# EAGLE design batteryholder2S6P_vertical_bottom (EAGLE 9.5.0)
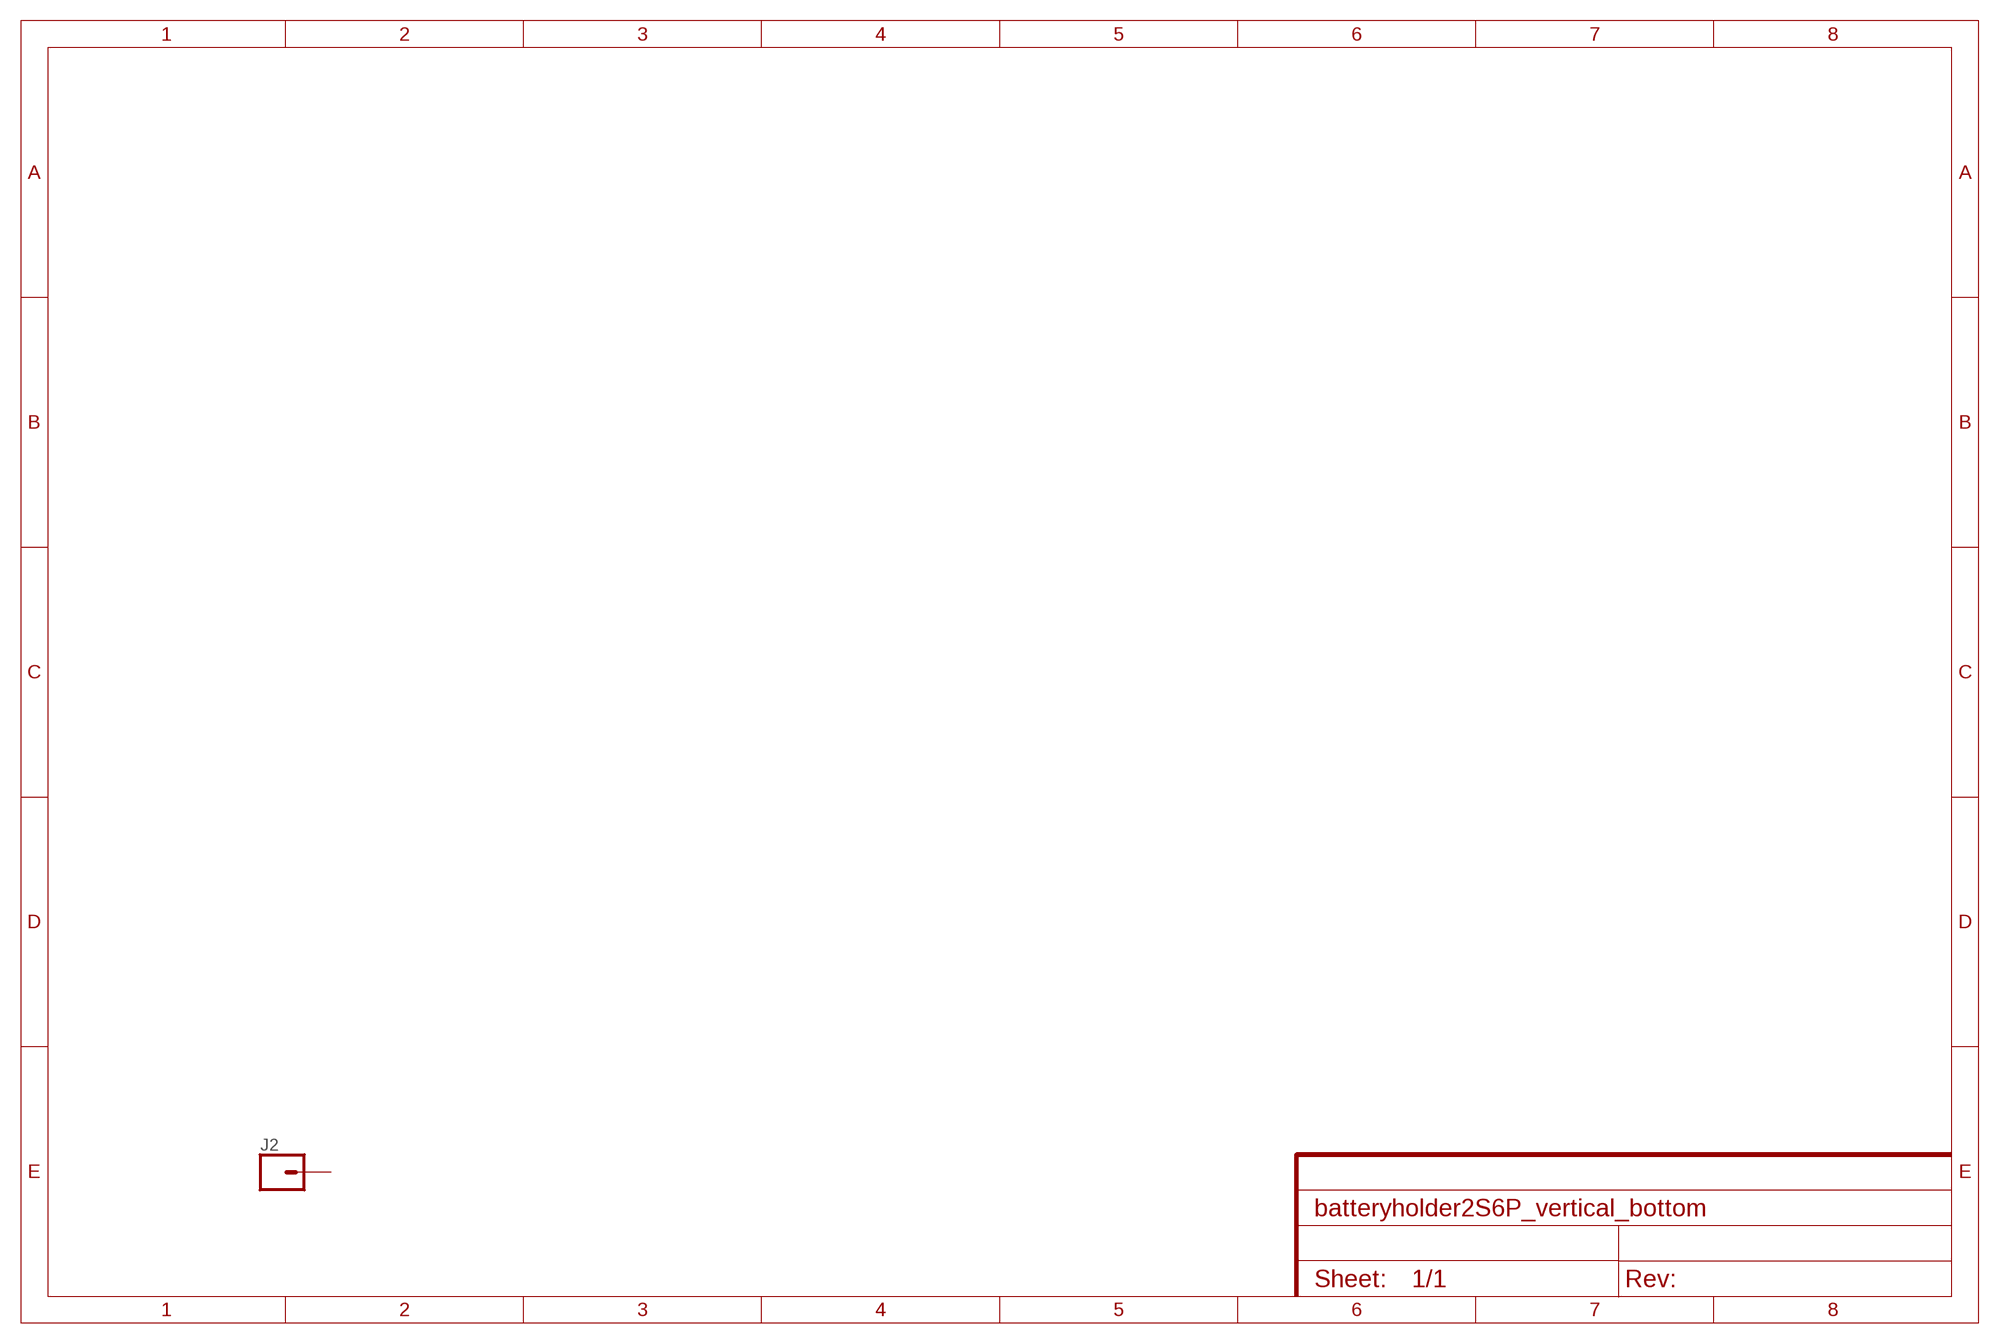
[diagram p0: schematic, sheet 1]

## Parts
J2  CONN_01PTH_2MM  [1X01_2MM]
Unconnected: J2.1

## Library data of the parts
J2 = SparkFun-Connectors:CONN_01: Single connection point. Often used as Generic Header-pin footprint for 0.1 inch spaced/style header connections On any of the 0.1 inch spaced packages, you can populate with these: Break Away Headers - Straight <https://www.sparkfun.com/products/116> (PRT-00116) Break Away Male Headers - Right Angle <https://www.sparkfun.com/products/553> (PRT-00553) Female Headers <https://www.sparkfun.com/products/115> (PRT-00115) Break Away Headers - Machine Pin <https://www.sparkfun.com/products/117> (PRT-00117) Break Away Female Headers - Swiss Machine Pin <https://www.sparkfun.com/products/743> (PRT-00743) This device is also useful as a general connection point to wire up your design to another part of your project. Our various solder wires solder well into these plated through hole pads. Hook-Up Wire - Assortment (Stranded, 22 AWG) <https://www.sparkfun.com/products/11375> (PRT-11375) Hook-Up Wire - Assortment (Solid Core, 22 AWG) <https://www.sparkfun.com/products/11367> (PRT-11367) View the entire wire category on our website here <https://www.sparkfun.com/categories/141> Special notes: SMTSO-256-ET is a "flush mount" nut for a 4-40 screw. We mostly use this on specialty testbeds; it is a nice way to connect hardware to your PCB at an adjustable hieght. Also note, the SNAP packages are for using a snappable style connector. We sell a baggie of snaps and they are also used on two LilyPad designs: Snap Assortment - 30 pack (male and female) <https://www.sparkfun.com/products/11347> (DEV-11347) LilyPad Arduino SimpleSnap <https://www.sparkfun.com/products/10941> (DEV-10941) LilyPad SimpleSnap Protoboard <https://www.sparkfun.com/products/10940> (DEV-10940)

## Board
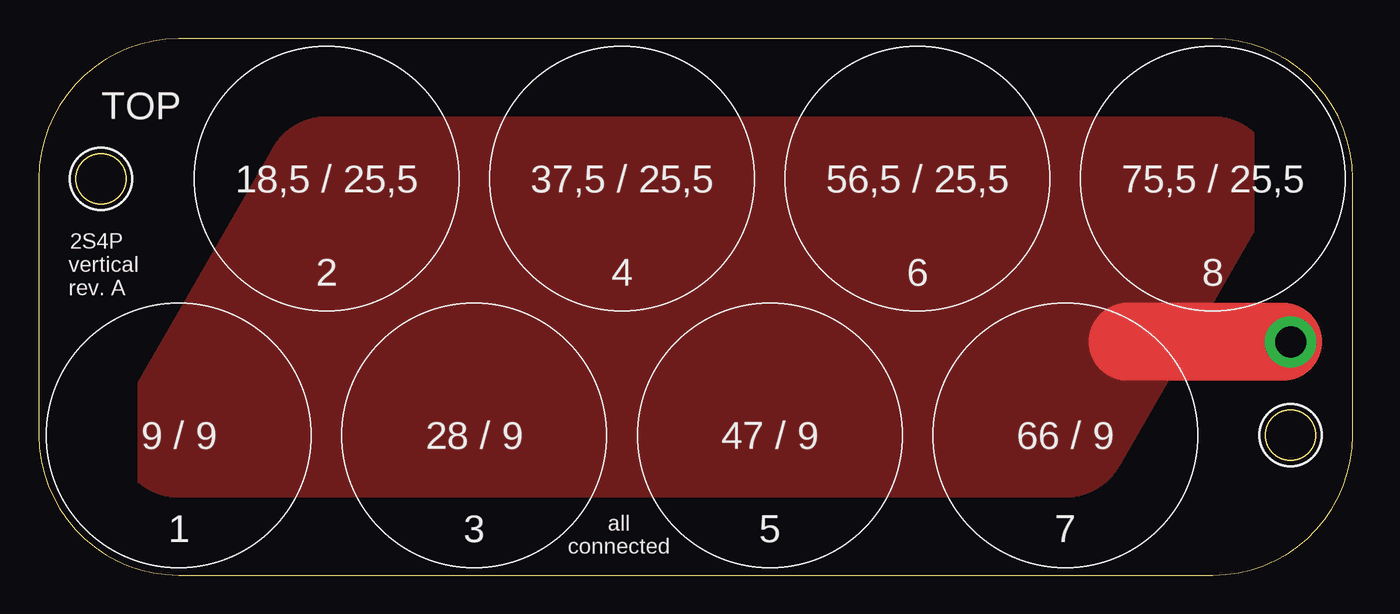
[diagram p1: board, top side]
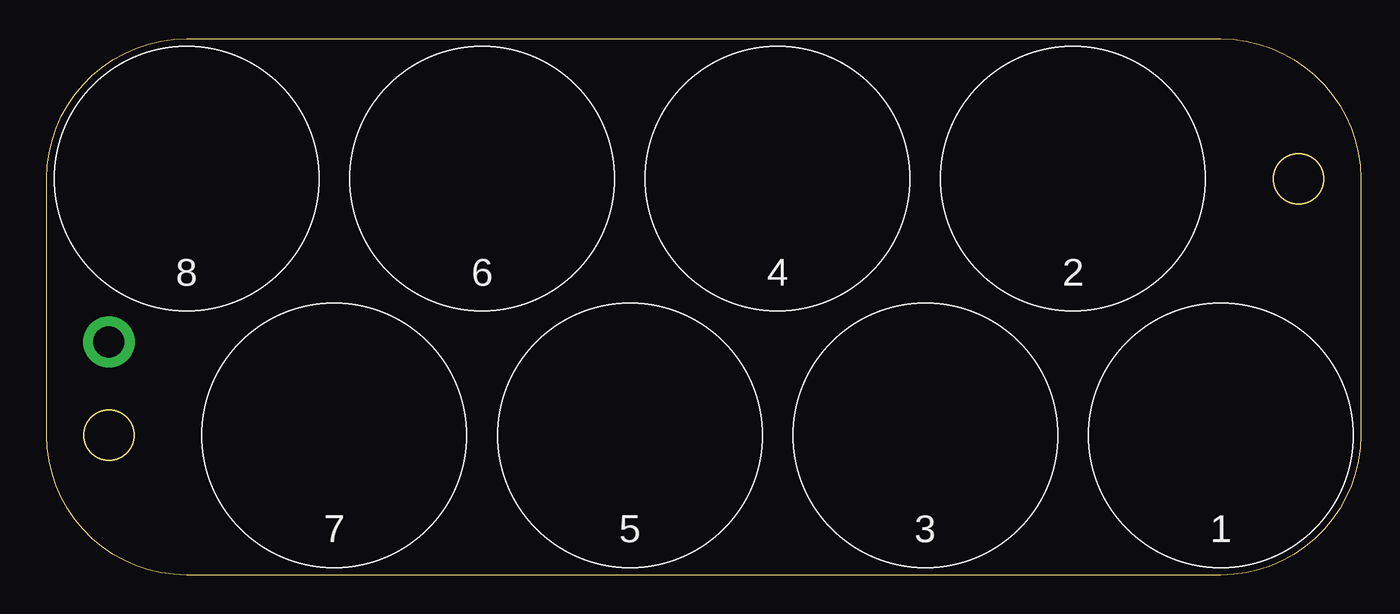
[diagram p2: board, bottom side, seen from below]

Size 84.5 x 34.5 mm. Coordinates in mm from the lower left corner, seen from the top.
Outline: 75.5,34.5 9,34.5 arc90 0,25.5 0,9 arc90 9,0 75.5,0 arc90 84.5,9 84.5,25.5 arc90 75.5,34.5
Outline: circle at 4,25.5 radius 1.6
Outline: circle at 80.5,9 radius 1.6
Copper layers (1*16): Top 0.035mm / dielectric 1.5mm / Bottom 0.035mm
Design rules "default": minimum track width 6mil, minimum drill 0.35mm, track to track 6mil, track to pad 6mil, pad to pad 6mil, via to via 6mil, smd to smd 6mil, copper to edge 40mil, drill to drill 6mil, minimum pad ring 10mil, minimum via ring 8mil, stop-mask expansion 4mil, vias tented up to drill 0mil, thermal gap 10mil

### Footprints (pad centres in the part's own frame; a part is rotated, then mirrored left to right if it is on the bottom)
1X01_2MM = drill 2 pad 3.302: 1 0,0

### Placement (x,y rotation side)
J2  80.5,15 0 top

### Tracks (layer width: path | path; a pad name or v marks a point on that pad's centre or on a via)
N$1
  Top 5: 80,15 70,15
  pour Top (no thermals): 9,9 18.5,25.5 75.5,25.5 66,9

### Text on the board
tPlace: TOP | 2S4P | vertical | 2 | 4 | 6 | 8 | rev. A | 1 | 3 | all / connected | 5 | 7
bPlace: 2 | 4 | 6 | 8 | 1 | 3 | 5 | 7
tNames: 18,5 / 25,5 | 37,5 / 25,5 | 56,5 / 25,5 | 75,5 / 25,5 | 9 / 9 | 28 / 9 | 47 / 9 | 66 / 9